# EAGLE design cruise (EAGLE 9.3.1)
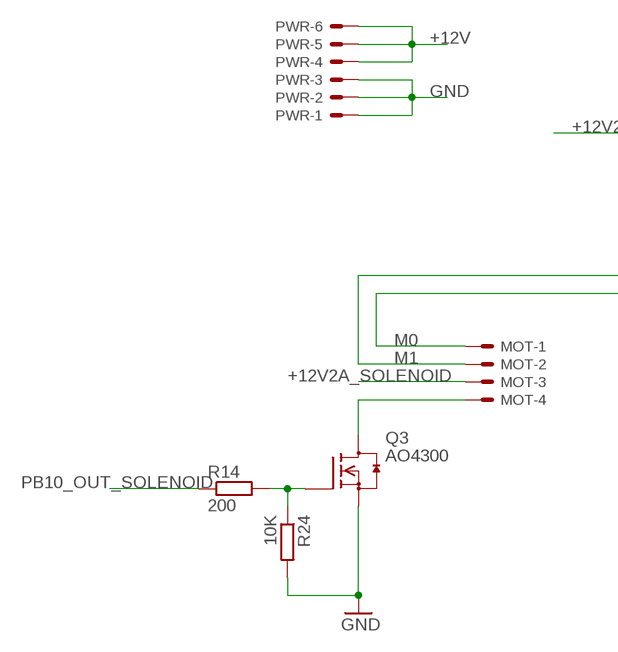
[diagram p0: schematic, sheet 1, part 1 of 2]
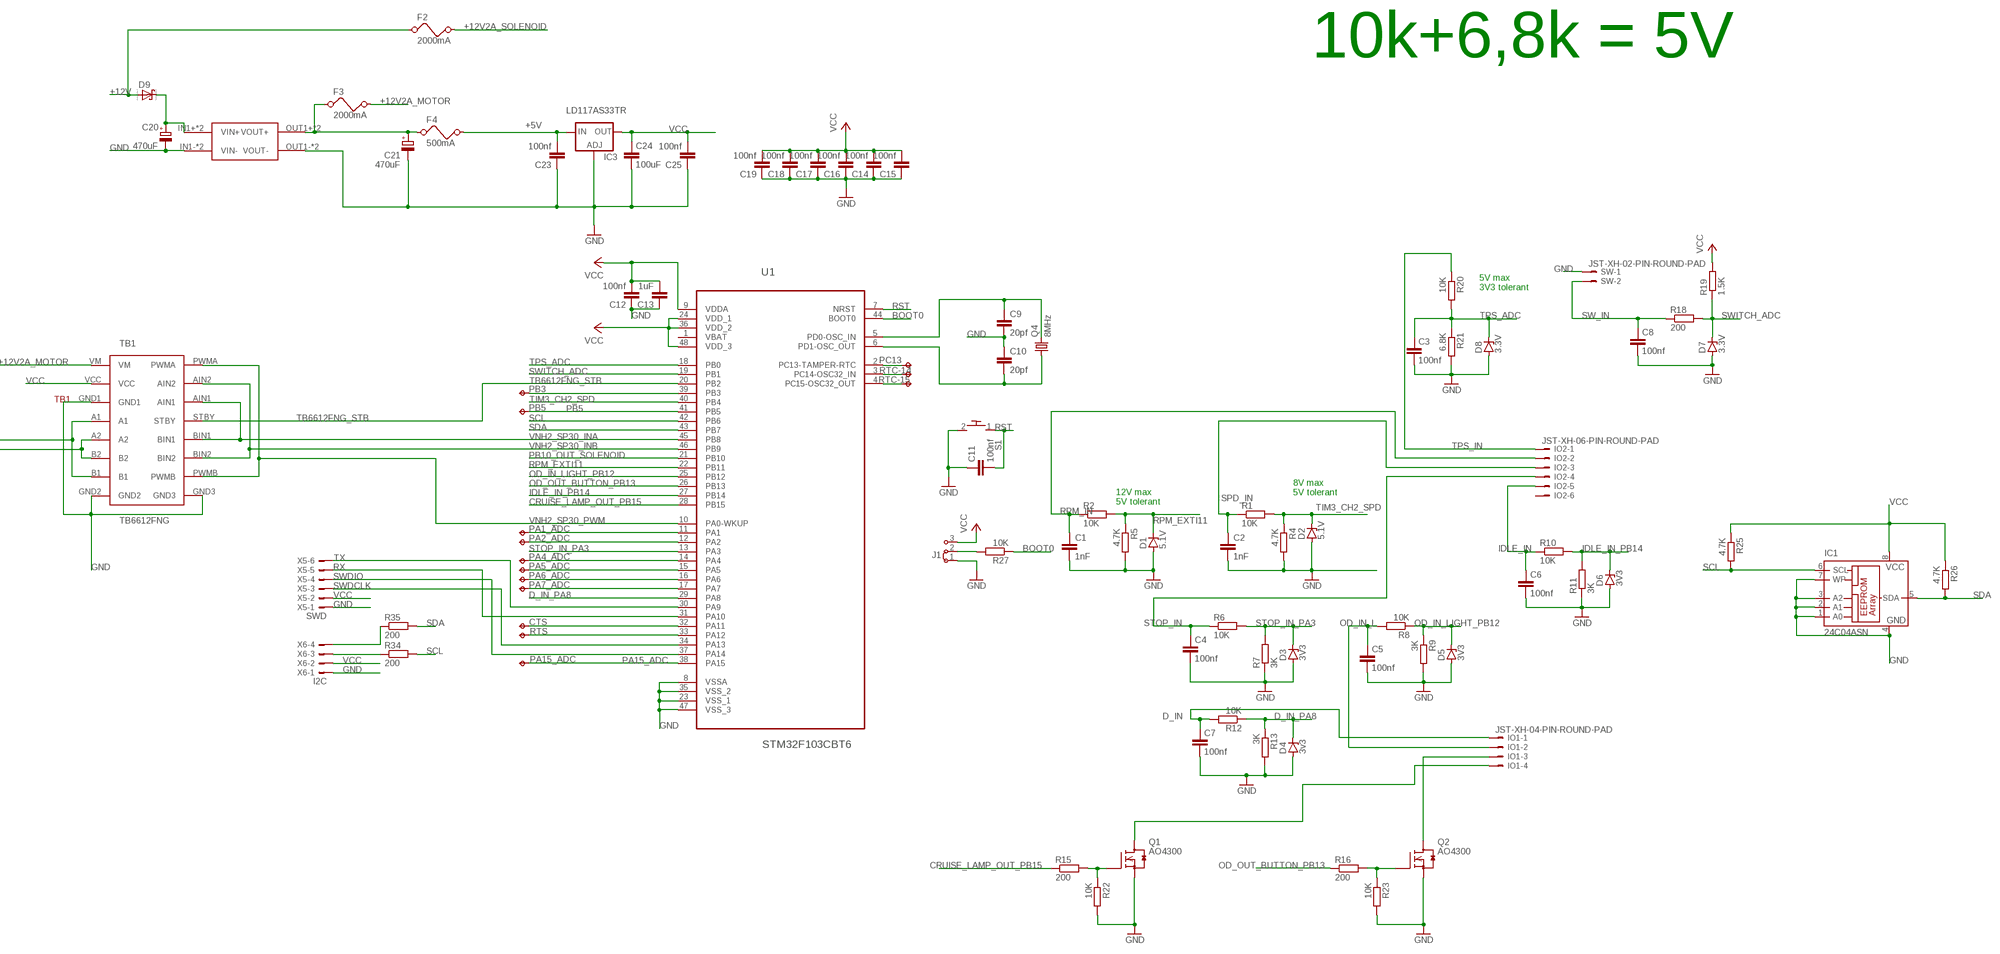
[diagram p1: schematic, sheet 1, part 2 of 2]

## Parts
C1  1nF  C-EUC0805K  [C0805K]
C2  1nF  C-EUC0805K  [C0805K]
C3  100nf  C-EUC0805K  [C0805K]
C4  100nf  C-EUC0805K  [C0805K]
C5  100nf  C-EUC0805K  [C0805K]
C6  100nf  C-EUC0805K  [C0805K]
C7  100nf  C-EUC0805K  [C0805K]
C8  100nf  C-EUC0805K  [C0805K]
C9  20pf  C-EUC0603  [C0603]
C10  20pf  C-EUC0603  [C0603]
C11  100nf  C-EUC0805K  [C0805K]
C12  100nf  C-EUC0805K  [C0805K]
C13  1uF  C-EUC0805K  [C0805K]
C14  100nf  C-EUC0805K  [C0805K]
C15  100nf  C-EUC0805K  [C0805K]
C16  100nf  C-EUC0805K  [C0805K]
C17  100nf  C-EUC0805K  [C0805K]
C18  100nf  C-EUC0805K  [C0805K]
C19  100nf  C-EUC0805K  [C0805K]
C20  470uF  CPOL-EUG  [PANASONIC_G]
C21  470uF  CPOL-EUG  [PANASONIC_G]
C23  100nf  C-EUC0805  [C0805]
C24  100uF  C-EUC1210  [C1210]
C25  100nf  C-EUC0805  [C0805]
CTS  TPTP09R  [TP09R]
D1  5.1V  ZENER-DIODESOD80C  [SOD80C]
D2  5.1V  ZENER-DIODESOD80C  [SOD80C]
D3  3V3  ZENER-DIODESOD80C  [SOD80C]
D4  3v3  ZENER-DIODESOD80C  [SOD80C]
D5  3V3  ZENER-DIODESOD80C  [SOD80C]
D6  3V3  ZENER-DIODESOD80C  [SOD80C]
D7  3.3V  ZENER-DIODESOD80C  [SOD80C]
D8  3.3V  ZENER-DIODESOD80C  [SOD80C]
D9  SCHOTTKY-DIODESMC  [DIODE_SMC]
F2  2000mA  FUSEC  [1206]
F3  2000mA  FUSEC  [1206]
F4  500mA  FUSEC  [1206]
IC1  24C04ASN  [SO-08]
IC3  LD117AS33TR  [SOT223]
IO1  JST-XH-04-PIN-ROUND-PAD  [JST-XH-04-PACKAGE-ROUND-PAD]
IO2  JST-XH-06-PIN-ROUND-PAD  [JST-XH-06-PACKAGE-ROUND-PAD]
J1  J2X2MM  [04C]
MOT  JST-XH-04-PIN-LONG-PAD  [JST-XH-04-PACKAGE-LONG-PAD]
PA1_ADC  TPTP09R  [TP09R]
PA2_ADC  TPTP09R  [TP09R]
PA4_ADC  TPTP09R  [TP09R]
PA5_ADC  TPTP09R  [TP09R]
PA6_ADC  TPTP09R  [TP09R]
PA7_ADC  TPTP09R  [TP09R]
PA15_ADC  TPTP09R  [TP09R]
PB3  TPTP09R  [TP09R]
PB5  TPTP09R  [TP09R]
PC13  TPTP09R  [TP09R]
PWR  JST-XH-06-PIN-LONG-PAD  [JST-XH-06-PACKAGE-LONG-PAD]
Q1  AO4300  BSS138  [SOT23]
Q2  AO4300  BSS138  [SOT23]
Q3  AO4300  BSS138  [SOT23]
Q4  8MHz  KX-9B  [5.0X3.2_2]
R1  10K  R-EU_R0805  [R0805]
R2  10K  R-EU_R0805  [R0805]
R4  4.7K  R-EU_R0805  [R0805]
R5  4.7K  R-EU_R0805  [R0805]
R6  10K  R-EU_R0805  [R0805]
R7  3K  R-EU_R0805  [R0805]
R8  10K  R-EU_R0805  [R0805]
R9  3K  R-EU_R0805  [R0805]
R10  10K  R-EU_R0805  [R0805]
R11  3K  R-EU_R0805  [R0805]
R12  10K  R-EU_R0805  [R0805]
R13  3K  R-EU_R0805  [R0805]
R14  200  R-EU_R0805  [R0805]
R15  200  R-EU_R0805  [R0805]
R16  200  R-EU_R0805  [R0805]
R18  200  R-EU_R0805  [R0805]
R19  1.5K  R-EU_R0805  [R0805]
R20  10K  R-EU_R0805  [R0805]
R21  6.8K  R-EU_R0805  [R0805]
R22  10K  R-EU_R0805  [R0805]
R23  10K  R-EU_R0805  [R0805]
R24  10K  R-EU_R0805  [R0805]
R25  4.7K  R-EU_R0805  [R0805]
R26  4.7K  R-EU_R0805  [R0805]
R27  10K  R-EU_R0805  [R0805]
R34  200  R-EU_R0805  [R0805]
R35  200  R-EU_R0805  [R0805]
RTC-14  TPTP09R  [TP09R]
RTC-15  TPTP09R  [TP09R]
RTS  TPTP09R  [TP09R]
S1  RESET_BUTTON  [EVQ-PJU05K]
SW  JST-XH-02-PIN-ROUND-PAD  [JST-XH-02-PACKAGE-ROUND-PAD]
TB1  TB6612FNG  [TB6612FNG]
U1  STM32F103CBT6  [QFP50P900X900X160-48N]
U$6  MP1584  [DC-BRICK]
X5  SWD  JST-XH-06-PIN-ROUND-PAD  [JST-XH-06-PACKAGE-ROUND-PAD]
X6  I2C  JST-XH-04-PIN-ROUND-PAD  [JST-XH-04-PACKAGE-ROUND-PAD]

## Nets
+5V: C23.2 F4.2 IC3.3(IN)
+12V: D9.A(C) F2.1 PWR.4 PWR.5 PWR.6
+12V2A_MOTOR: F3.2 TB1.VM
+12V2A_SOLENOID: F2.2 MOT.3
BOOT0: R27.1 U1.44(BOOT0)
CRUISE_LAMP_OUT_PB15: R15.1 U1.28(PB15)
D_IN: C7.1 IO1.1 R12.2
D_IN_PA8: D4.C R12.1 R13.1 U1.29(PA8)
GND: C1.2 C2.2 C3.2 C4.2 C5.2 C6.2 C7.2 C8.2 C9.2 C10.1 C12.1 C13.1 C14.1 C15.1 C16.1 C17.1 C18.1 C19.1 C20.- C21.- C23.1 C24.2 C25.1 D1.A D2.A D3.A D4.A D5.A D6.A D7.A D8.A IC1.1(A0) IC1.2(A1) IC1.3(A2) IC1.4(GND) IC1.7(WP) IC3.1(ADJ) J1.1 PWR.1 PWR.2 PWR.3 Q1.2(S) Q2.2(S) Q3.2(S) R4.2 R5.2 R7.1 R9.2 R11.1 R13.2 R21.2 R22.2 R23.2 R24.2 SW.1 TB1.GND1 TB1.GND2 TB1.GND3 U1.8(VSSA) U1.23(VSS_1) U1.35(VSS_2) U1.47(VSS_3) U$6.IN1-(VIN-) U$6.IN2-(VIN-) U$6.OUT1-(VOUT-) U$6.OUT2-(VOUT-) X5.1 X6.1
IDLE_IN: C6.1 IO2.5 R10.1
IDLE_IN_PB14: D6.C R10.2 R11.2 U1.27(PB14)
M0: MOT.1 TB1.A2 TB1.B2
M1: MOT.2 TB1.A1 TB1.B1
N$1: MOT.4 Q3.3(D)
N$2: C9.1 Q4.2 U1.5(PD0-OSC_IN)
N$3: C10.2 Q4.1 U1.6(PD1-OSC_OUT)
N$4: PA7_ADC.TP U1.17(PA7)
N$5: C21.+ F3.1 F4.1 U$6.OUT1+(VOUT+) U$6.OUT2+(VOUT+)
N$6: PB3.TP U1.39(PB3)
N$7: J1.2 R27.2
N$8: Q3.1(G) R14.2 R24.1
N$9: C11.1 S1.2 ; supply symbol labelled GND
N$10: Q1.1(G) R15.2 R22.1
N$11: R34.1 X6.3
N$12: R35.1 X6.4
N$14: Q2.1(G) R16.2 R23.1
N$15: PC13.TP U1.2(PC13-TAMPER-RTC)
N$16: RTC-14.TP U1.3(PC14-OSC32_IN)
N$17: RTC-15.TP U1.4(PC15-OSC32_OUT)
N$18: C20.+ D9.C(A) U$6.IN1+(VIN+) U$6.IN2+(VIN+)
N$25: PA1_ADC.TP U1.11(PA1)
N$26: PA2_ADC.TP U1.12(PA2)
N$28: PA4_ADC.TP U1.14(PA4)
N$29: PA6_ADC.TP U1.16(PA6)
N$30: PA5_ADC.TP U1.15(PA5)
N$32: IO1.4 Q1.3(D)
N$35: IO1.3 Q2.3(D)
N$37: CTS.TP U1.32(PA11)
N$38: RTS.TP U1.33(PA12)
OD_IN_L: C5.1 IO1.2 R8.2
OD_IN_LIGHT_PB12: D5.C R8.1 R9.1 U1.25(PB12)
OD_OUT_BUTTON_PB13: R16.1 U1.26(PB13)
PA15_ADC: PA15_ADC.TP U1.38(PA15)
PB5: PB5.TP U1.41(PB5)
PB10_OUT_SOLENOID: R14.1 U1.21(PB10)
RPM_EXTI11: D1.C R2.2 R5.1 U1.22(PB11)
RPM_IN: C1.1 IO2.2 R2.1
RST: C11.2 S1.1 U1.7(NRST)
RX: U1.31(PA10) X5.5
SCL: IC1.6(SCL) R25.2 R34.2 U1.42(PB6)
SDA: IC1.5(SDA) R26.2 R35.2 U1.43(PB7)
SPD_IN: C2.1 IO2.3 R1.1
STOP_IN: C4.1 IO2.4 R6.1
STOP_IN_PA3: D3.C R6.2 R7.2 U1.13(PA3)
SW_IN: C8.1 R18.1 SW.2
SWDCLK: U1.37(PA14) X5.4
SWDIO: U1.34(PA13) X5.3
SWITCH_ADC: D7.C R18.2 R19.1 U1.19(PB1)
TB6612FNG_STB: TB1.STBY U1.20(PB2)
TIM3_CH2_SPD: D2.C R1.2 R4.1 U1.40(PB4)
TPS_ADC: C3.1 D8.C R20.2 R21.1 U1.18(PB0)
TPS_IN: IO2.1 R20.1
TX: U1.30(PA9) X5.6
VCC: C12.2 C13.2 C14.2 C15.2 C16.2 C17.2 C18.2 C19.2 C24.1 C25.2 IC1.8(VCC) IC3.4(OUT) J1.3 R19.2 R25.1 R26.1 TB1.VCC U1.9(VDDA) U1.24(VDD_1) U1.36(VDD_2) U1.48(VDD_3) X5.2 X6.2
VNH2_SP30_INA: TB1.AIN1 TB1.BIN1 U1.45(PB8)
VNH2_SP30_INB: TB1.AIN2 TB1.BIN2 U1.46(PB9)
VNH2_SP30_PWM: TB1.PWMA TB1.PWMB U1.10(PA0-WKUP)
Unconnected: IO2.6 U1.1(VBAT)

## Notes on the sheet
- 10k+6,8k = 5V
- 5V max
  3V3 tolerant
- 8V max
  5V tolerant
- 12V max
  5V tolerant

## Library data of the parts
C1-C8 C10-C19 C23 C25 = rcl:C-EU: CAPACITOR, European symbol; SPICEPREFIX: C
C9 C24 = resistor:C-EU: CAPACITOR, European symbol
C20 C21 = rcl:CPOL-EU: POLARIZED CAPACITOR, European symbol; SPICEPREFIX: C
CTS PA1_ADC PA2_ADC PA4_ADC PA5_ADC PA6_ADC PA7_ADC PA15_ADC PB3 PB5 PC13 RTC-14 RTC-15 RTS = testpad:TP: Test pad
D1-D8 = diode:ZENER-DIODE: Z-Diode
D9 = eagle-ltspice:SCHOTTKY-DIODE: Schottky Diode; SPICEMODEL: NONE; SPICEPREFIX: D; SPICETYPE: diode
F2-F4 = m-pad-2.1:FUSE: Fuse's in various packages
IC1 = microchip:24C*: Serial EEPROM 1 K/2 K/4 K; OC_FARNELL: unknown; OC_NEWARK: unknown
IC3 = v-reg:LD117A?*: Low drop fixed and adjustable positive voltage regulators 1 A Source: http://www.st.com/stonline/products/literature/ds/7194/ld1117axx.pdf
IO1 MOT X6 = Rembrandt Electronics - JST XH Connectors v1-0:JST-XH-04-PIN: JST XH Connector 2 Pin Wire to board connector. Pitch: 2,54 mm, (0.100") Number of pins: 4 Created by Rembrandt Electronics www.rembrandtelectronics.com
IO2 PWR X5 = Rembrandt Electronics - JST XH Connectors v1-0:JST-XH-06-PIN: JST XH Connector 2 Pin Wire to board connector. Pitch: 2,54 mm, (0.100") Number of pins: 6 Created by Rembrandt Electronics www.rembrandtelectronics.com
J1 = jumper:J2: Jumper switch 2 x 2.5 mm
Q1-Q3 = m-pad-2.1:BSS138: Fairchild Semiconductors BSS138 N-Channel Logic Level Enhancement Mode Field Effect Transistor General Description: These N-Channel enhancement mode field effect transistors are produced using Fairchild's proprietary, high cell density, DMOS technology. These products have been designed to minimize on-state resistance while provide rugged, reliable, and fast switching performance.These products are particularly suited for low voltage, low current applications such as small servo motor control, power MOSFET gate drivers, and other switching applications. Features: 0.22 A, 50 V. RDS(ON) = 3.5Ohm @ VGS = 10 V RDS(ON) = 6.0Ohm @ VGS = 4.5 V High density cell design for extremely low RDS(ON) Rugged and Reliable Compact industry standard SOT-23 surface mount package Please send any comments to: messi@users.sourceforge.net
Q4 = crystal-geyer_V1_0:KX: Quartz Crystals (MHz) SMD: KX - Serie Model Size l/w/h [mm] Frequency Range Frequency Stability Temp. Range [°C] Load Capacitance AECQ 200 availabel Datasheet KX-4 KX-5 KX-6 KX-7 KX-9A KX-9B KX-12A KX-12B KX-13 KX-20 KX-K KX-KS 1.6/1.2/0.3 2.0/1.6/0.45 2.5/2.0/0.55 3.2/2.5/0.8 5.0/3.2/1.0 5.0/3.2/1.1 6.0/3.5/1.1 6.0/3.5/1.0 7.0/5.0 /1.3 11.6/5.5/1.6 12.3/4.5/4.2 12.3/4.5/3.2 24.0 ~ 80.0 MHz 16.0 ~ 80.0 MHz 12.0 ~ 80.0 MHz 8.0 ~ 60.0 MHz 7,68 ~ 300,0 MHz 8,0 ~ 50,0 MHz 8,0 ~ 150,0 MHz 8,0 ~ 50,0 MHz 6,0 ~ 160,0 MHz 3,579 ~ 25,0 MHz 3,579 ~ 70,0 MHz 3,579 ~ 70,0 MHz ±10 … ±50ppm ±10 … ±50ppm ±10 … ±50ppm ±10 … ±50ppm ±10 … ±50ppm ±10 … ±50ppm ±10 … ±50ppm ±10 … ±50ppm ±10 … ±50ppm ±50ppm ±10 … ±50ppm ±10 … ±50ppm (*) -40°C …+85°C (*) -40°C …+125°C (*) -40°C …+125°C (*) -40°C …+125°C (*) -40°C …+105°C (*) -40°C …+105°C (*) -40°C …+125°C (*) -40°C …+105°C (*) -40°C …+105°C (*) -40°C …+105°C (*) -40°C …+85°C (*) -40°C …+85°C 8, 8…16 8, 8…16 10, 8…16 12, 7…20 16, 10…20 16, 10…20 16, 10…20 16, 12…20 16, 12…20 16, 12…20 16, 12…30 16, 12…30 - yes yes yes - - - - - - - - KX-4.pdf <http://www.geyer-electronic.de/uploads/tx_userartikelfrequenz/GEYER-KX-4.pdf> KX-5.pdf <http://www.geyer-electronic.de/uploads/tx_userartikelfrequenz/GEYER-KX-5.pdf> KX-6.pdf <http://www.geyer-electronic.de/uploads/tx_userartikelfrequenz/GEYER-KX-6.pdf> KX-7.pdf <http://www.geyer-electronic.de/uploads/tx_userartikelfrequenz/GEYER-KX-7.pdf> KX-9A.pdf <http://www.geyer-electronic.de/uploads/tx_userartikelfrequenz/GEYER-KX-9A.pdf> KX-9B.pdf <http://www.geyer-electronic.de/uploads/tx_userartikelfrequenz/GEYER-KX-9B.pdf> KX-12A.pdf <http://www.geyer-electronic.de/uploads/tx_userartikelfrequenz/GEYER-KX-12A.pdf> KX-12B.pdf <http://www.geyer-electronic.de/uploads/tx_userartikelfrequenz/GEYER-KX-12B.pdf> KX-13.pdf <http://www.geyer-electronic.de/uploads/tx_userartikelfrequenz/GEYER-KX-13.pdf> KX-20.pdf <http://www.geyer-electronic.de/uploads/tx_userartikelfrequenz/GEYER-KX-20.pdf> KX-K.pdf <http://www.geyer-electronic.de/uploads/tx_userartikelfrequenz/GEYER-KX-K.pdf> KX-KS.pdf <http://www.geyer-electronic.de/uploads/tx_userartikelfrequenz/GEYER-KX-KS.pdf> <http://www.geyer-electronic.de/fileadmin/template/img/logo-geyer-electronic.png> Details see: http://www.geyer-electronic.de/Frequenz-Produkte.9.0.html Created 2016-06-07, Hans Locher 2016 (C) Geyer Quartz Technology KX4,KX5,KX6,KX7,KX9A,KX9B,KX12A,KX12B,KX13,KX20,KXK,KXKS;1612;2016;2520;3225;5032;6035;7050;11655;12345;1,6x1,2;2,0x1,6;2,5x2,0;3,2x2,5;5,0x3,2;6,0x3,5;7,0x5,0;11,6x5,5;12,3x4,5;12,3x4,5;1.6x1.2;2.0x1.6;2.5x2.0;3.2x2.5;5.0x3.2;6.0x3.5;7.0x5.0;11.6x5.5;12.3x4.5;12.3x4.5;
R1 R2 R4-R16 R18-R27 R34 R35 = resistor:R-EU_: RESISTOR, European symbol
S1 = m-pad-2.1:RESET_BUTTON
SW = Rembrandt Electronics - JST XH Connectors v1-0:JST-XH-02-PIN: JST XH Connector 2 Pin Wire to board connector. Pitch: 2,54 mm, (0.100") Number of pins: 2 Created by Rembrandt Electronics www.rembrandtelectronics.com
TB1 = TB6612FNG:TB6612FNG
U1 = ST Microelctronics_By_element14_Batch_1:STM32F103CBT6: Medium-density performance line ARM-based 32-bit MCU; MPN: STM32F103CBT6; OC_FARNELL: 1606327; OC_NEWARK: 11N8296; PACKAGE: QFP-48; SUPPLIER: STMICROELECTRONICS
U$6 = MP1584-dc-brick:MP1584: MP1584-dc-brick-pcb Step down Input: 4.5V - 28V Ouput 0.8V - 25V max. 3A Cheap on ebay

## Board
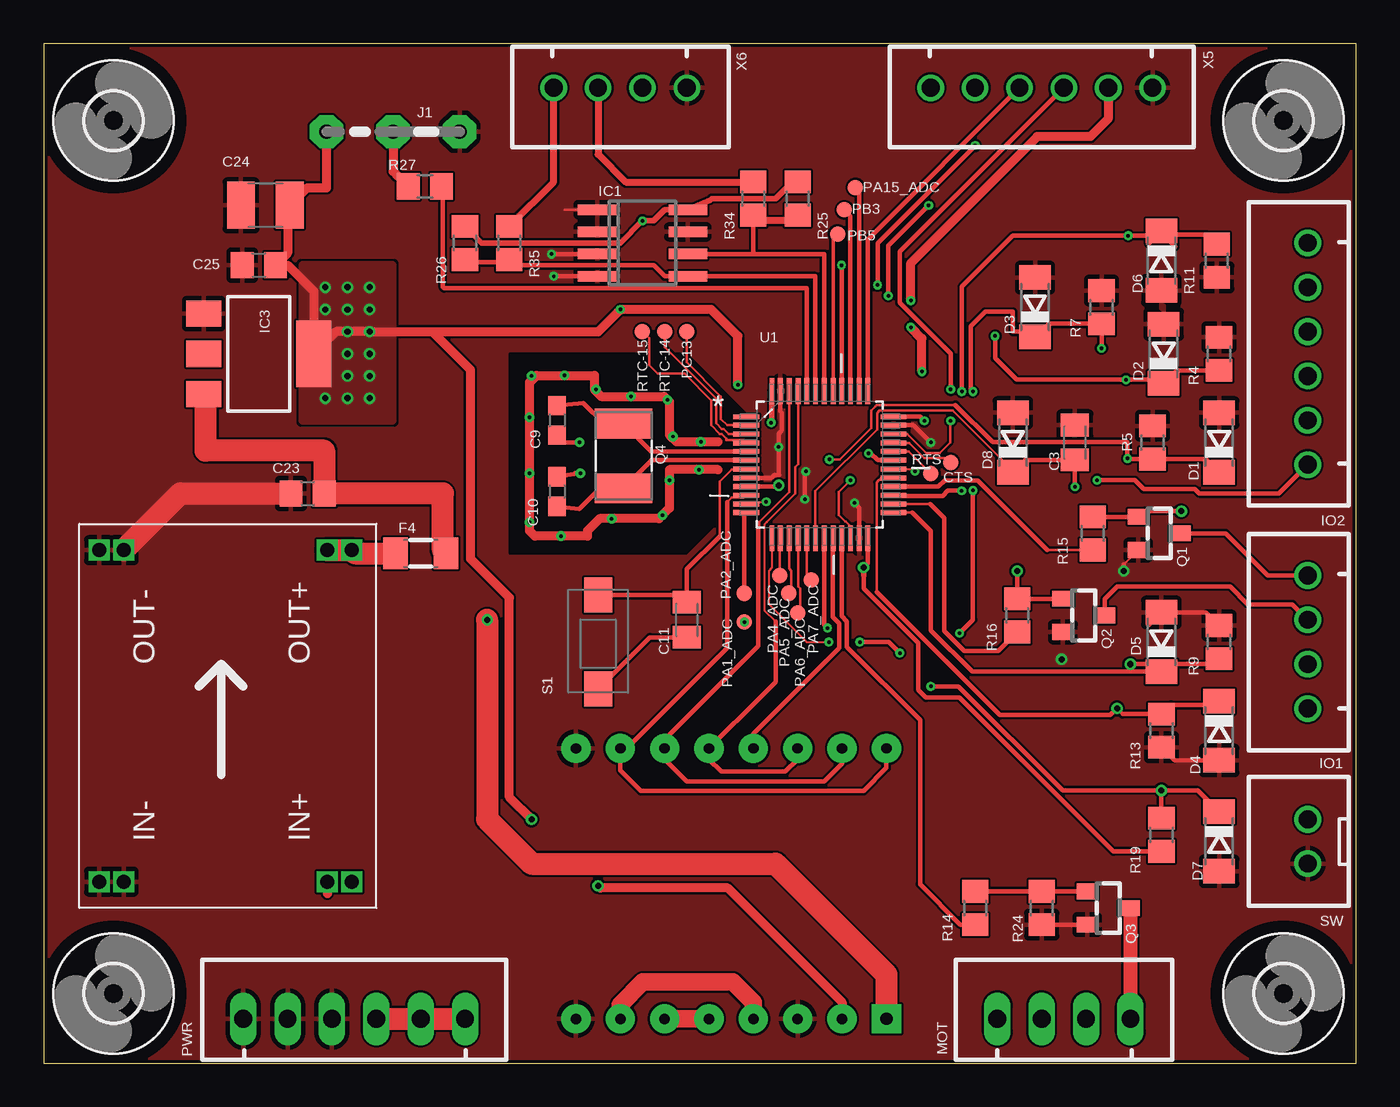
[diagram p2: board, top side]
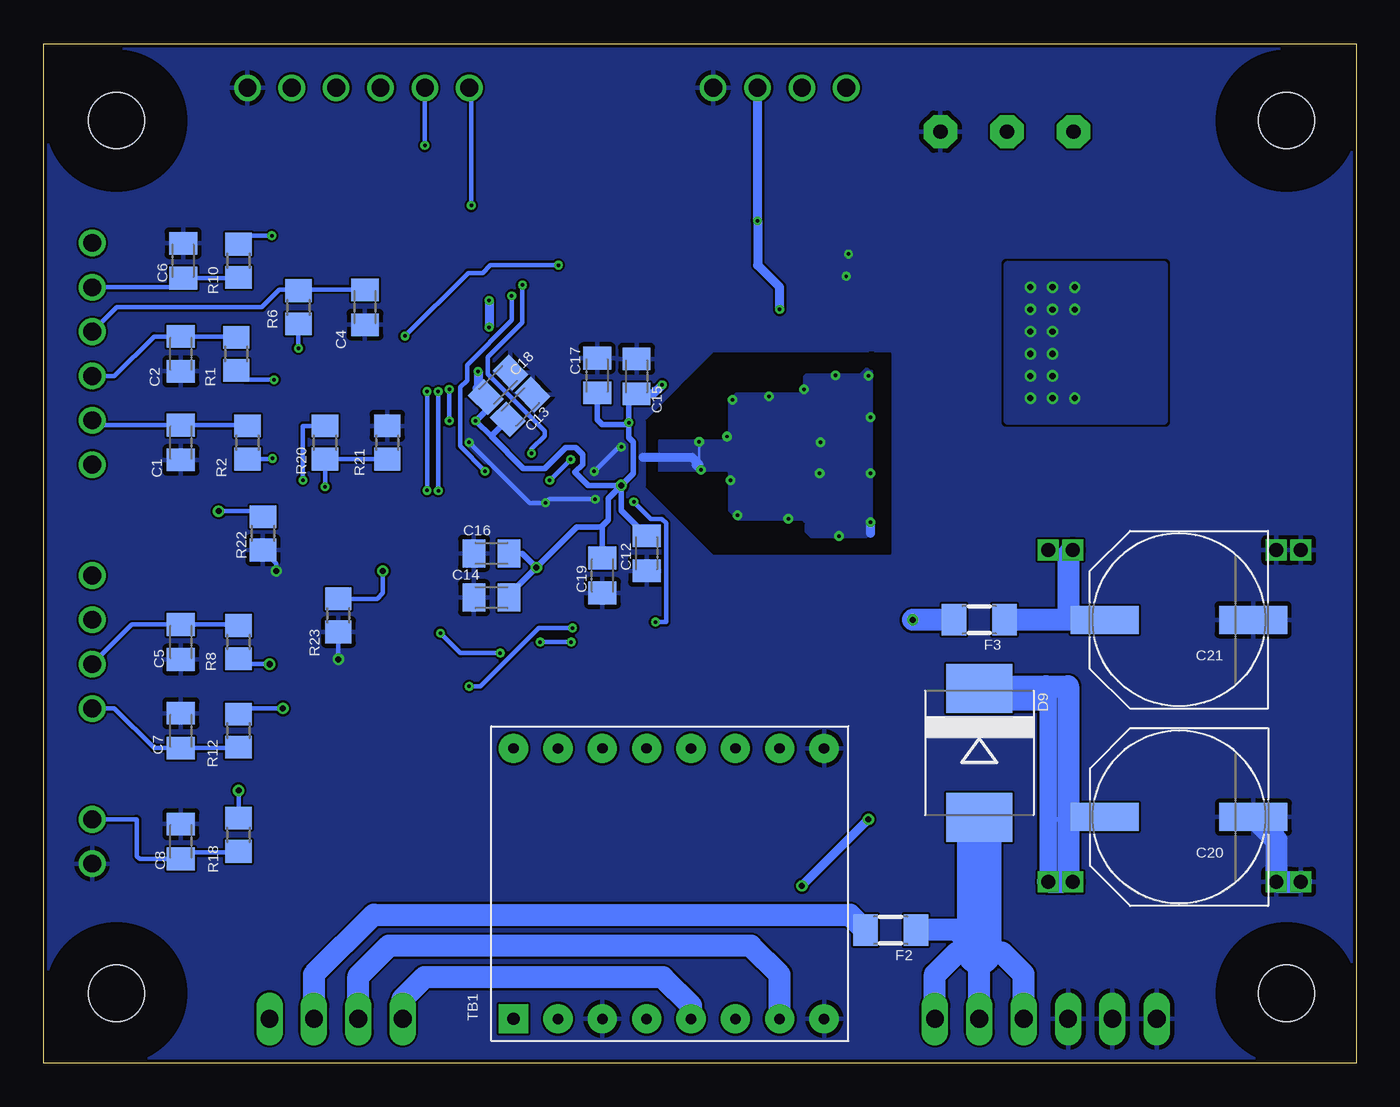
[diagram p3: board, bottom side, seen from below]

Size 75.17 x 58.41 mm. Coordinates in mm from the lower left corner, seen from the top.
Outline: 0,0 75.17,0 75.17,58.41 0,58.41 0,0
Copper layers (1*16): Top 0.035mm / dielectric 1.5mm / Bottom 0.035mm
Design rules "jlcpcb": minimum track width 5mil, minimum drill 0.2mm, track to track 5mil, track to pad 5mil, pad to pad 5mil, via to via 5mil, smd to smd 5mil, copper to edge 0.2mm, drill to drill 6mil, minimum pad ring 0.2mm, minimum via ring 0.15mm, stop-mask expansion 4mil, vias tented up to drill 0mil, thermal gap 10mil

### Footprints (pad centres in the part's own frame; a part is rotated, then mirrored left to right if it is on the bottom)
C0805K = smd 1.3 x 1.6: 1 -1,0; 2 1,0
C0603 = smd 1.1 x 1: 1 -0.85,0; 2 0.85,0
PANASONIC_G = smd 3.9 x 1.6: + 4.25,0; - -4.25,0
C0805 = smd 1.3 x 1.5: 1 -0.95,0; 2 0.95,0
C1210 = smd 1.6 x 2.7: 1 -1.4,0; 2 1.4,0
TP09R = smd 0.9 x 0.9: TP 0,0
SOD80C = smd 1.4 x 1.8: A 1.7,0; C -1.7,0
DIODE_SMC = smd 2.8 x 3.8: A 3.7,0; C -3.7,0
1206 = smd 1.4 x 1.8: 1 -1.45,0; 2 1.45,0
SO-08 = smd 0.6 x 2.2: 1 -1.905,-2.6; 2 -0.635,-2.6; 3 0.635,-2.6; 4 1.905,-2.6; 5 1.905,2.6; 6 0.635,2.6; 7 -0.635,2.6; 8 -1.905,2.6
SOT223 = smd 1.5 x 2: 1 -2.3,-3.15; 2 0,-3.15; 3 2.3,-3.15 | smd 3.8 x 2: 4 0,3.15
JST-XH-04-PACKAGE-ROUND-PAD = drill 1.016: 1 -3.81,0; 2 -1.27,0; 3 1.27,0; 4 3.81,0
JST-XH-06-PACKAGE-ROUND-PAD = drill 1.016: 1 -6.35,0; 2 -3.81,0; 3 -1.27,0; 4 1.27,0; 5 3.81,0; 6 6.35,0
04C = drill 0.813 pad 1.905 octagon: 1 -1.905,0; 2 1.905,0; 3 5.715,0
JST-XH-04-PACKAGE-LONG-PAD = drill 1.016 long: 1 -3.81,0; 2 -1.27,0; 3 1.27,0; 4 3.81,0
JST-XH-06-PACKAGE-LONG-PAD = drill 1.016 long: 1 -6.35,0; 2 -3.81,0; 3 -1.27,0; 4 1.27,0; 5 3.81,0; 6 6.35,0
SOT23 = smd 0.9 x 1.2: 1 -0.95,-1.2; 2 0.95,-1.2; 3 0,1.2
5.0X3.2_2 = smd 1.7 x 3.3: 1 -1.85,0; 2 1.85,0
R0805 = smd 1.3 x 1.5: 1 -0.95,0; 2 0.95,0
EVQ-PJU05K = smd 1.6 x 2: 1 0,2.7; 2 0,-2.7
JST-XH-02-PACKAGE-ROUND-PAD = drill 1.016: 1 -1.27,0; 2 1.27,0
TB6612FNG = drill 0.6 pad 1.676: A1 -7.62,-1.27; A2 -7.62,-3.81; AIN1 7.874,1.27; AIN2 7.874,3.81; B1 -7.62,-8.89; B2 -7.62,-6.35; BIN1 7.874,-3.81; BIN2 7.874,-6.35; GND1 -7.62,1.27; GND2 -7.62,-11.43; GND3 7.874,-11.43; PWMA 7.874,6.35; PWMB 7.874,-8.89; STBY 7.874,-1.27; VCC -7.62,3.81 | drill 0.7 pad 1.676 square: VM -7.62,6.35
QFP50P900X900X160-48N = smd 1.473 x 0.279: 1 -4.216,2.743; 2 -4.216,2.261; 3 -4.216,1.753; 4 -4.216,1.245; 5 -4.216,0.762; 6 -4.216,0.254; 7 -4.216,-0.254; 8 -4.216,-0.762; 9 -4.216,-1.245; 10 -4.216,-1.753; 11 -4.216,-2.261; 12 -4.216,-2.743; 25 4.216,-2.743; 26 4.216,-2.261; 27 4.216,-1.753; 28 4.216,-1.245; 29 4.216,-0.762; 30 4.216,-0.254; 31 4.216,0.254; 32 4.216,0.762; 33 4.216,1.245; 34 4.216,1.753; 35 4.216,2.261; 36 4.216,2.743 | smd 0.279 x 1.473: 13 -2.743,-4.216; 14 -2.261,-4.216; 15 -1.753,-4.216; 16 -1.245,-4.216; 17 -0.762,-4.216; 18 -0.254,-4.216; 19 0.254,-4.216; 20 0.762,-4.216; 21 1.245,-4.216; 22 1.753,-4.216; 23 2.261,-4.216; 24 2.743,-4.216; 37 2.743,4.216; 38 2.261,4.216; 39 1.753,4.216; 40 1.245,4.216; 41 0.762,4.216; 42 0.254,4.216; 43 -0.254,4.216; 44 -0.762,4.216; 45 -1.245,4.216; 46 -1.753,4.216; 47 -2.261,4.216; 48 -2.743,4.216
3,2 = hole 3.2: 0,0
DC-BRICK = drill 0.8 square: IN1+ 1.5,1.4; IN1- 1.5,14.47; IN2+ 1.5,2.8; IN2- 1.5,15.87; OUT1+ 20.5,1.4; OUT1- 20.5,14.47; OUT2+ 20.5,2.8; OUT2- 20.5,15.87

### Placement (x,y rotation side)
C1  67.31,35.56 270 bottom
C2  67.31,40.64 270 bottom
C3  59.05,35.56 90 top
C4  56.77,43.31 270 bottom
C5  67.31,24.13 270 bottom
C6  67.18,45.97 90 bottom
C7  67.31,19.05 90 bottom
C8  67.31,12.7 90 bottom
C9  29.4,36.83 270 top
C10  29.4,32.75 270 top
C11  36.83,25.4 90 top
C12  40.64,29.21 90 bottom
C13  47.88,37.59 225 bottom
C14  49.53,26.67 0 bottom
C15  41.22,39.35 270 bottom
C16  49.53,29.21 0 bottom
C17  43.48,39.4 270 bottom
C18  49.15,38.86 225 bottom
C19  43.18,27.94 90 bottom
C20  10.15,14.1 180 bottom
C21  10.16,25.4 180 bottom
C23  15.11,32.64 0 top
C24  12.7,49.15 180 top
C25  12.32,45.72 0 top
CTS  50.8,33.78 0 top
D1  67.31,35.56 90 top
D2  64.14,40.64 90 top
D3  56.77,43.31 90 top
D4  67.31,19.05 270 top
D5  64.01,24.13 90 top
D6  64.01,45.97 270 top
D7  67.31,12.7 270 top
D8  55.5,35.56 90 top
D9  21.59,17.78 270 bottom
F2  26.67,7.62 180 bottom
F3  21.59,25.4 180 bottom
F4  21.59,29.21 0 top
IC1  34.29,46.99 270 top
IC3  12.32,40.64 270 top
IO1  72.39,24.13 90 top
IO2  72.39,40.64 90 top
J1  21.91,53.37 180 top
MOT  58.42,2.54 0 top
PA1_ADC  40.13,25.27 0 top
PA2_ADC  40.13,26.92 0 top
PA4_ADC  42.16,27.94 0 top
PA5_ADC  42.67,26.92 0 top
PA6_ADC  43.18,25.78 0 top
PA7_ADC  43.94,27.69 0 top
PA15_ADC  46.48,50.16 0 top
PB3  45.85,48.9 0 top
PB5  45.47,47.5 0 top
PC13  36.83,41.91 0 top
PWR  17.78,2.54 0 top
Q1  63.88,30.35 270 top
Q2  59.56,25.65 270 top
Q3  60.96,8.89 270 top
Q4  33.21,34.79 90 top
R1  64.14,40.64 270 bottom
R2  63.5,35.56 270 bottom
R4  67.31,40.64 90 top
R5  63.5,35.56 90 top
R6  60.58,43.31 270 bottom
R7  60.58,43.31 270 top
R8  64.01,24.13 90 bottom
R9  67.31,24.13 90 top
R10  64.01,45.97 90 bottom
R11  67.18,45.97 90 top
R12  64.01,19.05 270 bottom
R13  64.01,19.05 270 top
R14  53.34,8.89 90 top
R15  60.07,30.35 90 top
R16  55.75,25.65 90 top
R18  64.01,13.08 90 bottom
R19  64.01,13.08 270 top
R20  59.05,35.56 270 bottom
R21  55.5,35.56 90 bottom
R22  62.61,30.35 270 bottom
R23  58.29,25.65 270 bottom
R24  57.15,8.89 270 top
R25  43.18,49.53 270 top
R26  24.13,46.99 270 top
R27  21.83,50.23 180 top
R34  40.64,49.53 270 top
R35  26.67,46.99 270 top
RTC-14  35.56,41.91 0 top
RTC-15  34.29,41.91 0 top
RTS  51.94,34.42 0 top
S1  31.75,24.13 0 top
SW  72.39,12.7 90 top
TB1  41.91,10.16 90 bottom
U1  44.45,34.29 0 top
U$2  [3,2]  4,54 0 top
U$3  [3,2]  71,54 0 top
U$4  [3,2]  71,4 0 top
U$5  [3,2]  4,4 0 top
U$6  19.05,8.89 90 top
X5  57.15,55.88 180 top
X6  33.02,55.88 180 top

### Tracks (layer width: path | path; a pad name or v marks a point on that pad's centre or on a via)
+5V
  Top 1.27: F4.2 22.86,29.39 22.86,32.64 C23.2 16.06,35.09 9.27,35.09 9.27,38.24 IC3.3
+12V
  Top 1.27: PWR.4 PWR.5 PWR.6
  Bottom 1.27: F2.1 25.2,7.64 22.88,7.64 21.59,6.35 | PWR.4 19.05,5.1 20.3,6.35 21.59,6.35 | PWR.6 24.13,5.1 24.11,5.1 22.86,6.35 21.59,6.35 | PWR.5 21.59,6.35
  Bottom 2.54: 21.59,6.35 D9.A
+12V2A_MOTOR  (via drill 0.35)
  Top 1.27: v25.4,25.4 25.4,13.97 27.94,11.43 41.91,11.43 48.26,5.08 TB1.VM
  Bottom 1.27: F3.2 v25.4,25.4
+12V2A_SOLENOID
  Bottom 1.27: MOT.3 59.69,5.08 56.26,8.51 29.01,8.51 F2.2
BOOT0
  Top 0.152: 22.92,44.39 22.86,44.45 | 22.86,50.15 R27.1
  Top 0.254: U1.44 43.69,44.39 22.92,44.39 | 22.86,44.45 22.86,50.15
CRUISE_LAMP_OUT_PB15
  Top 0.152: 59.87,29.61 R15.1 57.47,29.4
  Top 0.254: U1.28 51.24,33.05 51.59,33.39 53.48,33.39 57.47,29.4
D_IN
  Bottom 0.152: 64.06,18.05 R12.2
  Bottom 0.2: 67.58,17.78 C7.1
  Bottom 0.254: 64.06,18.05 C7.1 68.85,18.05 71.12,20.32 IO1.1
D_IN_PA8  (via drill 0.35)
  Top 0.152: 68.06,20 67.53,20.54 D4.C | 47.7,26.99 47.7,33.28 47.84,33.41 47.93,33.5 48.64,33.5 U1.29
  Top 0.2: R12.1 64.54,20.54 | 61.79,20 v61.47,20.32
  Top 0.254: 64.54,20.54 67.53,20.54 | R12.1 61.79,20 | v61.47,20.32 61.09,19.94 54.76,19.94 47.7,26.99
  Bottom 0.2: R12.1 63.69,20.32
  Bottom 0.254: 63.69,20.32 v61.47,20.32
GND  (via drill 0.2, 0.2 pad 0.55, 0.35)
  Top 0.152: 43.59,33.85 v43.64,33.9 | 42.19,38.1 U1.47 | 42.09,33.74 42.12,33.71 42.13,33.71 | D5.A 63.58,25.83 | D8.A 55.07,36.83 | C9.2 29.67,35.56 | 29.84,48.9 IC1.1 | Q1.2 61.85,28.57
  Top 0.254: 63.26,25.08 D5.A 66.56,25.83 R9.2 | R24.2 Q3.2 | U1.35 49.81,36.55 v50.8,35.56 | v46.43,32.1 46.71,31.82 U1.23 | v43.59,32.31 43.59,33.85 | 42.09,33.74 v42.09,35.3 42.09,36.06 42.27,36.24 42.27,37.26 42.19,37.34 U1.47 | 42.12,33.71 41.84,33.71 41.66,33.53 U1.8 | R13.2 64.76,17.35 D4.A | 29.67,35.56 v30.68,35.56 | C10.1 30.38,33.75 30.43,33.8 v30.73,33.8 | 61.85,28.57 v61.85,28.19 | IC1.4 v29.21,45.09 | IC1.3 v29.08,46.35
  Top 0.508: 38.63,34 v37.53,34 35.83,34 v35.83,33.4 35.83,31.8 v35.43,31.4 35.23,31.2 v32.53,31.2 31.83,31.2 31.13,30.5 31.13,30.2 v29.63,30.2 28.13,30.2 27.83,30.5 v27.83,31 v27.83,33.8 v27.83,37 27.83,39 28.23,39.4 v29.83,39.4 31.53,39.4 31.53,38.6 31.93,38.2 v33.63,38.2 35.53,38.2 v35.73,38 35.83,37.9 35.83,36 36.23,35.6 v37.63,35.6 38.63,35.6
  Top 1.27: U$6.OUT1- 7.83,32.64 C23.1 | 11.3,48.49 C24.2
  Bottom 0.152: 55.45,36.56 R21.2 | R22.2 62.29,29.08 | v37.63,35.6 37.63,34.29 37.63,34.1 v37.53,34
  Bottom 0.254: v50.8,35.56 47.34,32.1 v46.43,32.1 46.22,32.31 v43.59,32.31 | v43.64,33.9 42.24,35.3 v42.09,35.3 | R22.2 61.85,28.64 v61.85,28.19 | R23.2 v58.29,23.14
  Bottom 0.508: v27.83,31 27.83,30.37 | v37.53,34 37.82,34.29 | 37.63,34.29 38.04,34.7 40.85,34.7
  Bottom 1.27: C20.- 4.58,12.78 U$6.IN1- U$6.IN2-
  other vias: 27.94,39.37 31.63,38.6 36.03,35.9
  pour Top (isolate 0.1, rank 2): 0.25,58.42 0.25,2.54 2.79,0 74.93,0 74.93,58.42
  pour Bottom (rank 6): 0,58.42 74.93,58.42 74.93,0 0,0
IDLE_IN
  Bottom 0.152: 67.71,44.45 C6.1
  Bottom 0.2: 64.06,44.97 R10.1
  Bottom 0.254: C6.1 64.06,44.97 | IO2.5 67.71,44.45
IDLE_IN_PB14  (via drill 0.2)
  Top 0.152: 64.01,47.56 D6.C 63.79,47.46 | 48.7,32.5 U1.27
  Top 0.2: R11.2 66.65,47.46 | 64.17,47.4 64.01,47.56
  Top 0.254: 63.26,46.92 63.79,47.46 66.65,47.46 | v52.58,38.48 52.58,44.48 55.5,47.4 v62.1,47.4 64.17,47.4 64.8,46.77 | v52.57,32.8 51.77,32.8 51.47,32.5 48.7,32.5
  Bottom 0.152: v52.58,32.81 v52.57,32.8 | R10.2 63.53,47.4
  Bottom 0.254: v52.58,38.48 v52.58,32.81 | 63.53,47.4 v62.1,47.4
M0
  Top 1.016: TB1.B2 TB1.A2
  Bottom 1.27: TB1.A2 38.1,3.31 39.71,4.93 53.36,4.93 54.61,3.68 MOT.1
M1
  Top 1.016: TB1.B1 33.02,3.35 34.31,4.65 39.47,4.65 40.64,3.48 TB1.A1
  Bottom 1.27: MOT.2 57.15,4.99 55.4,6.73 34.67,6.73 33.02,5.08 TB1.B1
N$1
  Top 0.813: Q3.3 62.23,8.82 MOT.4
N$2
  Top 0.152: Q4.2 32.09,36.64
  Top 0.254: U1.5 34.8,35.05 Q4.2 | C9.1 30.9,37.83 32.09,36.64
N$3
  Top 0.152: Q4.1 31.87,32.94
  Top 0.254: U1.6 34.81,34.54 Q4.1 | C10.2 30.68,31.75 31.87,32.94
N$4
  Top 0.152: PA7_ADC.TP 43.69,27.94 U1.17
N$5
  Top 1.27: U$6.OUT2+ U$6.OUT1+ 17.83,29.21 F4.1
  Bottom 1.016: 16.51,25.4 C21.+ 13.97,25.4
  Bottom 1.27: U$6.OUT2+ 16.51,29.13 16.51,25.4 F3.1
N$6
  Top 0.152: 46.2,48.54 PB3.TP
  Top 0.254: U1.39 46.2,48.54
N$7
  Top 0.254: 20.32,50.8 R27.2
  Top 0.508: J1.2 20.01,51.1 20.32,50.8
N$8
  Top 0.254: Q3.1 R24.1 R14.2
N$9
  Top 0.254: S1.2 34.72,24.4 C11.1
N$10  (via drill 0.35)
  Top 0.152: Q1.1 63,31.62
  Top 0.254: Q1.1 R15.2 | v65.15,31.62 63,31.62
  Bottom 0.152: R22.1 62.93,31.62
  Bottom 0.254: v65.15,31.62 62.93,31.62
N$11
  Top 0.406: X6.3 31.75,52.07 33.34,50.48 R34.1
N$12
  Top 0.406: R35.1 29.21,50.48 X6.4
N$14  (via drill 0.35)
  Top 0.254: v55.75,28.19 R16.2 Q2.1
  Bottom 0.254: v55.75,28.19 55.75,26.92 56.07,26.6 R23.1
N$15
  Top 0.152: U1.2 39.14,36.55 38.79,36.91 38.79,38.2 36.83,40.16 PC13.TP
N$16
  Top 0.152: U1.3 39.23,36.04 38.94,36.34 38.83,36.34 38.51,36.66 38.51,38.09 35.56,41.03 RTC-14.TP
N$17
  Top 0.152: U1.4 40.08,35.69 39.09,35.69 39.09,35.79 38.82,36.06 38.72,36.06 38.23,36.55 38.23,37.97 36.7,39.5 35.18,39.5 34.67,40.01 34.67,41.53 RTC-15.TP
N$18
  Top 0.508: U$6.IN2+ 16.25,9.72
  Bottom 1.016: U$6.IN1+ 17.65,20.83 | 17.65,20.83 17.65,21.46 17.78,21.59 | D9.C 21.23,21.48 20.45,20.7 17.78,20.7 17.65,20.83
  Bottom 1.27: D9.C 21.48,21.59 17.78,21.59 16.51,21.59 16.51,13.97 | 16.51,13.97 16.51,10.65 | 16.51,10.65 U$6.IN2+ | U$6.IN1+ 16.77,10.39 16.51,10.65 | C20.+ 14.53,13.97 16.51,13.97
N$25  (via drill 0.2)
  Top 0.127: U1.11 40.36,32.16 v41.38,32.16
  Bottom 0.254: PA1_ADC.TP 39.52,25.27 39.52,30.94 39.76,31.18 40.4,31.18 v41.38,32.16
  other vias: 40.13,25.27
N$26
  Top 0.254: U1.12 40.13,31.45 PA2_ADC.TP
N$28
  Top 0.152: U1.14 42.16,30.05 PA4_ADC.TP
N$29
  Top 0.152: U1.16 43.2,27.31 43.33,27.2 43.33,25.93 PA6_ADC.TP
N$30
  Top 0.152: U1.15 42.7,28.33 42.82,28.21 42.82,27.07 PA5_ADC.TP
N$32
  Top 0.254: Q1.3 67.69,30.35 70.1,27.94 IO1.4
N$35
  Top 0.254: IO1.3 71.5,26.29 68.96,26.29 67.94,27.3 61.47,27.3 60.76,26.6 Q2.3
N$37
  Top 0.152: U1.32 49.53,35.05 CTS.TP
N$38
  Top 0.152: U1.33 49.57,35.53 50.43,34.67 51.69,34.67 RTS.TP
OCS_CUTOUT
  cutout Bottom: 27.94,40.64 36.83,40.64 40.64,36.83 40.64,33.02 36.83,29.21 26.67,29.21 26.67,39.37 26.8,39.5 27.53,39.5 27.63,39.4 27.63,30.4 28.03,30 31.23,30 31.63,30.4 31.63,30.9 31.73,31 35.43,31 36.03,31.6 36.03,33.8 40.03,33.8 40.03,35.7 40.13,35.8 36.23,35.8 36.03,36 36.03,38 35.53,38.5 31.83,38.5 31.73,38.6 31.73,39.4 31.53,39.6 28.43,39.6 28.13,39.9 27.63,39.9 27.63,40.7 27.88,40.7
OD_IN_L
  Bottom 0.152: 64.06,25.13 R8.2
  Bottom 0.254: 64.06,25.13 C5.1 70.12,25.13 IO1.2
OD_IN_LIGHT_PB12  (via drill 0.35)
  Top 0.152: 49.73,31.55 U1.25 | 63.58,22.86 D5.C 64.44,22.86
  Top 0.2: R9.1 67.31,22.86
  Top 0.254: 49.73,31.55 50.8,30.48 50.8,24.8 53.17,22.43 D5.C | 63.58,22.86 v62.23,22.86 | 64.44,22.86 67.31,22.86
  Bottom 0.2: R8.1 64.01,22.86
  Bottom 0.254: v62.23,22.86 64.01,22.86
OD_OUT_BUTTON_PB13
  Top 0.152: 55.59,24.54 R16.1 | 50.77,32.03 U1.26
  Top 0.254: R16.1 54.67,23.62 52.7,23.62 51.56,24.77 51.56,31.24 50.77,32.03
OSC_CUTOUT
  cutout Top: 26.67,40.64 26.67,29.21 36.83,29.21 40.64,33.02 40.64,36.83 36.83,40.64
OSC_GND_REMOVE
  cutout Bottom: 26.67,39.37 26.67,40.64 27.94,40.64 27.94,39.91 27.83,39.8 27.73,39.8 27.63,39.7 27.63,39.3 27.56,39.37
PA15_ADC
  Top 0.152: 46.71,49.94 PA15_ADC.TP
  Top 0.254: U1.38 46.71,49.94
PB5
  Top 0.152: 45.21,47.24 PB5.TP
  Top 0.203: U1.41 45.21,47.24
PB10_OUT_SOLENOID
  Top 0.254: U1.21 45.7,25.62 46,25.32 46,23.85 50.19,19.66 50.19,10.25 52.5,7.94 R14.1
RPM_EXTI11  (via drill 0.2)
  Top 0.152: 46.2,33.38 v46.19,33.39 45.53,32.73 45.53,31.4 45.89,31.04 45.93,31.04 46.2,30.77 U1.22 | v44.99,34.59 45.59,34.59 47.4,36.4 47.4,37.39 47.61,37.61 47.71,37.7 52.21,37.7 | 62.1,34.61 v62.07,34.64 62.04,34.67
  Top 0.2: 63.46,34.57 R5.1
  Top 0.254: D1.C 66.56,34.61 R5.1 62.1,34.61 | 62.04,34.67 62.04,35.58 54.34,35.58 52.21,37.7
  Bottom 0.152: 62.1,34.61 v62.07,34.64
  Bottom 0.254: v44.99,34.59 v46.19,33.39 | 62.1,34.61 R5.1
RPM_IN
  Bottom 0.2: R2.1 63.55,36.56
  Bottom 0.254: 63.55,36.56 C1.1 72.12,36.56 IO2.2
RST
  Top 0.152: 36.4,26.83 C11.2 | U1.7 40.22,34.02 39.4,34.02 38.71,33.33 38.71,30.18
  Top 0.254: S1.1 36.4,26.83 | 38.71,30.18 36.83,28.3 C11.2
RX  (via drill 0.2)
  Top 0.254: U1.31 47.76,34.54 47.37,34.94 v47.24,34.94 | v47.75,44.58 47.75,46.98 v53.34,52.58
  Bottom 0.152: X5.5
  Bottom 0.254: v47.24,34.94 47.24,35.18 46.48,35.94 46.48,36.22 49.73,39.47 49.73,40.44 47.75,42.42 v47.75,44.58 | v53.34,52.58 X5.5
SCL
  Top 0.152: R34.2 40.64,48.26 | R25.2 42.86,48.26
  Top 0.254: U1.42 44.7,46.35 40.64,46.35 | 40.64,46.35 IC1.6 | 40.64,48.26 40.64,46.35
  Top 0.406: 42.86,48.26 40.64,48.26
SDA
  Top 0.152: R35.2 26.83,45.88 26.99,45.72 | R26.2 24.29,45.88
  Top 0.254: U1.43 44.2,45.09 IC1.5 35.56,45.09 34.92,45.72 26.99,45.72 | 24.29,45.88 26.83,45.88
SPD_IN
  Bottom 0.152: 64.19,41.64 R1.1
  Bottom 0.254: 64.19,41.64 C2.1 68.85,41.64 71.12,39.37 IO2.3
STOP_IN
  Bottom 0.2: 56.5,44.58 C4.1 | 60.53,44.31 R6.1
  Bottom 0.254: C4.1 60.53,44.31 | IO2.4 70.99,43.31 62.67,43.31 61.67,44.31 60.63,44.31 R6.1
STOP_IN_PA3  (via drill 0.2)
  Top 0.127: U1.13 41.71,28.39 41.52,28.2 41.52,26.29 43.69,24.13 v44.96,24.13
  Top 0.152: 41.73,30.1 U1.13 | v53.21,38.48 53.09,38.61 | 56.47,41.91 D3.C
  Top 0.2: D3.C 57.52,42.36
  Top 0.254: 57.52,42.36 R7.2 v60.58,40.96 | v46.74,24.13 48.39,24.13 v49.02,23.5 | 53.09,38.61 53.09,42.23 53.91,43.05 55.5,43.05 55.5,41.91 56.47,41.91 | v52.45,24.64 53.21,25.4 v53.21,32.81
  Bottom 0.254: v53.21,38.48 v53.21,32.81 | v44.96,24.13 v46.74,24.13 | v49.02,23.5 51.31,23.5 v52.45,24.64 | R7.2 v60.58,40.96
SW_IN
  Bottom 0.2: 69.85,13.97 69.83,13.95 | 64.06,12.08 R18.1
  Bottom 0.254: SW.2 69.85,13.97 | 69.83,13.95 69.83,11.86 69.67,11.7 C8.1 66.93,12.08 64.06,12.08
SWDCLK
  Top 0.254: X5.4 47.19,47.19 U1.37
SWDIO  (via drill 0.2)
  Top 0.152: U1.34 49.46,36.04 50.55,34.95 51.3,34.95 51.91,35.56 51.91,36.77 v51.94,36.8
  Top 0.254: v51.94,38.61 51.94,40.64 49.02,43.56 49.02,46.48 X5.3
  Bottom 0.254: v51.94,38.61 v51.94,36.8
SWITCH_ADC  (via drill 0.2, 0.35)
  Top 0.254: v50.8,21.59 52.38,21.59 58.35,15.62 v64.01,15.62 | D7.C 66.09,15.62 v64.01,15.62 | R19.1 v64.01,15.62 | v44.88,24.93 44.7,25.11 U1.19
  Bottom 0.152: 44.9,24.95 v44.88,24.93
  Bottom 0.254: R19.1 v64.01,15.62 | v44.88,24.93 46.83,24.93 50.16,21.59 v50.8,21.59
TB6612FNG_STB
  Top 0.254: TB1.STBY 40.64,18.87 45.57,23.8 45.57,25.19 45.2,25.56 45.2,30.06 U1.20
TIM3_CH2_SPD  (via drill 0.2)
  Top 0.127: v45.7,45.72 v45.69,45.72
  Top 0.254: U1.40 v45.7,45.72 | 63.92,39.16 D2.C 64.89,39.69 R4.1 | 63.92,39.16 63.7,39.37 | v54.48,41.66 54.48,40.39 55.71,39.16 v61.98,39.16 63.92,39.16
  Bottom 0.127: 63.81,39.37 R1.2
  Bottom 0.2: R1.2 63.6,39.16
  Bottom 0.254: v45.69,45.72 49.59,45.72 50.03,45.28 50.86,45.28 v54.48,41.66 | 63.6,39.16 v61.98,39.16
TPS_ADC  (via drill 0.2)
  Top 0.152: C3.1 59.01,34.61 | U1.18 44.2,32.77 47.73,36.3 47.73,37.26 47.85,37.38 52.07,37.38 55.42,34.03 | D8.C 55.33,34.03
  Top 0.2: 56.2,34.56 D8.C 55.07,34.29
  Top 0.254: 56.2,34.56 C3.1 v59.05,33.02 | 55.42,34.03 55.33,34.03
  Bottom 0.254: R21.1 R20.2 v59.05,33.02
TPS_IN  (via drill 0.2)
  Top 0.254: v60.33,33.4 62.48,33.4 62.99,32.89 65.91,32.89 66.17,32.64 70.74,32.64 IO2.1
  Bottom 0.254: R20.1 60.33,36.51 v60.33,33.4
TX  (via drill 0.2)
  Top 0.127: U1.30 49.77,34.04 v49.9,33.91
  Top 0.254: v48.37,43.97 48.37,46.83 v50.68,49.14
  Bottom 0.127: v49.9,33.91 49.9,33.93
  Bottom 0.254: 49.9,33.93 51.32,35.35 51.32,38.73 50.93,39.12 50.93,40.01 48.37,42.56 v48.37,43.97 | v50.68,49.14 50.68,55.76 X5.6
VCC  (via drill 0.2, 0.35)
  Top 0.152: 38.26,49.53 38.18,49.45
  Top 0.254: U1.9 42.04,33.05 v42.09,33.1 | U1.36 50.19,37.03 v50.43,36.8 | U1.24 47.19,28.64 v46.95,28.4 46.95,27.19 50.07,24.08 50.07,21.39 50.52,20.95 52.44,20.95 61.26,12.13 R19.2
  Top 0.305: U1.48 41.71,36.75 v41.66,36.7 | 46.95,27.94 v46.95,28.4 | R26.1 25.08,46.99 33.02,46.99 v34.29,48.26 34.92,48.26 35.56,48.9 IC1.8 38.18,49.45 | R25.1 42.86,50.48 41.91,49.53 38.26,49.53
  Top 0.508: v27.94,13.97 26.67,15.24 26.67,26.67 24.43,28.91 24.43,39.73 22.25,41.91 | v31.75,10.16 31.88,10.03 39.17,10.03 45.72,3.48 TB1.VCC | 22.25,41.91 v18.67,41.91 v17.4,41.91 16.74,41.91 IC3.4 15.47,44.22 13.97,45.72 C25.2 13.97,46.42 13.97,49.02 C24.1 15.1,50.15 16.2,50.15 J1.3 | 22.25,41.91 31.75,41.91 v33.02,43.18 38.23,43.18 39.75,41.66 v39.75,38.86 | v49.66,43.69 49.66,45.85 56.9,53.09 59.94,53.09 60.96,54.1 X5.2 | v50.3,39.62 50.3,41.52 v49.66,42.16
  Bottom 0.305: v41.66,36.7 41.66,35.83 41.41,35.58 41.41,33.78 v42.09,33.1 | 49.55,35.92 47.71,34.07 46.47,34.07 45.27,35.27 44.71,35.27 44.31,34.87 44.31,34.31 44.76,33.86 44,33.1 v42.09,33.1 | 49.55,35.92 v50.43,36.8 49.86,37.37 C18.2 | 43.25,30.72 42.85,31.12 42.85,32.34 v42.09,33.1 | v41.66,36.7 41.66,37.91 C15.2 | v41.66,36.7 41.79,36.57 43.18,36.57 43.48,36.87 C17.2 | 49.55,35.92 C13.2 | C12.2 42.09,31.66 v42.09,33.1 | C19.2 43.18,30.65 43.25,30.72 | v46.95,28.4 47.77,29.21 C16.2 | v46.95,28.4 48.53,26.82 C14.2 | v46.95,28.4 44.64,30.72 43.25,30.72
  Bottom 0.508: v27.94,13.97 v31.75,10.16 | C15.2 40.26,38.35 v39.75,38.86 | C18.2 50.35,38.65 50.3,38.71 v50.3,39.62 | v49.66,43.69 v49.66,42.16 | v33.02,43.18 33.02,44.45 34.29,45.72 v34.29,48.26 X6.2
  other vias: 16.13,44.45 17.4,44.45 18.67,44.45 18.67,43.18 17.4,43.18 16.13,43.18 17.4,40.64 18.67,40.64 17.4,39.37 18.67,39.37 18.67,38.1 17.4,38.1 16.13,38.1
  pour Top (no thermals): 19.94,36.83 14.86,36.83 14.86,45.72 19.94,45.72
  pour Bottom (isolate 1.27): 11.05,45.72 11.05,36.83 19.94,36.83 19.94,45.72
VNH2_SP30_INA
  Top 0.127: 41.91,25.3 41.27,25.93 41.27,30.87 41.39,31
  Top 0.152: U1.45 43.2,34.32 43.03,34.15 43.03,32.64 41.39,31 | 41.15,21.08 41.21,21.14
  Top 0.254: 38.1,17.54 TB1.BIN1 | TB1.BIN1 41.15,21.08 41.91,21.84 41.91,25.3 | TB1.BIN1 38.1,17.41 38.8,16.71 42.48,16.71 43.18,17.41 TB1.AIN1
VNH2_SP30_INB
  Top 0.152: U1.46 42.7,32.73 40.91,30.94
  Top 0.254: TB1.AIN2 45.72,17.16 44.71,16.15 36.82,16.15 35.56,17.41 TB1.BIN2 35.56,18.54 40.91,23.89 40.91,30.94
VNH2_SP30_PWM
  Top 0.152: TB1.PWMB 33.4,18.03 | 39.14,32.14 39.4,32.4 40.09,32.4 U1.10
  Top 0.254: 33.4,18.03 39.14,23.77 39.14,32.14 | TB1.PWMB 33.02,16.78 34.2,15.6 46.95,15.6 48.26,16.91 TB1.PWMA